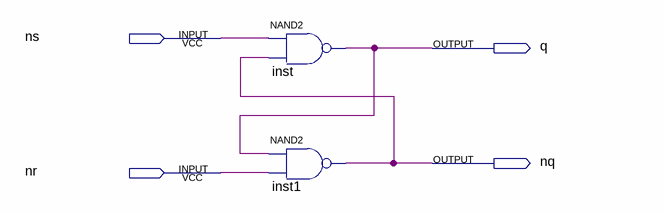
[diagram p0: schematic sheet]
// Quartus schematic s51_nsnr.bdf as structural Verilog: 2 symbols, 4 pins
module s51_nsnr (
  input  ns,
  input  nr,
  output q,
  output nq
);

  nand inst (q, ns, nq);
  nand inst1 (nq, q, nr);
endmodule
